# EAGLE schematic RemoteHardware (EAGLE 9.3.0)
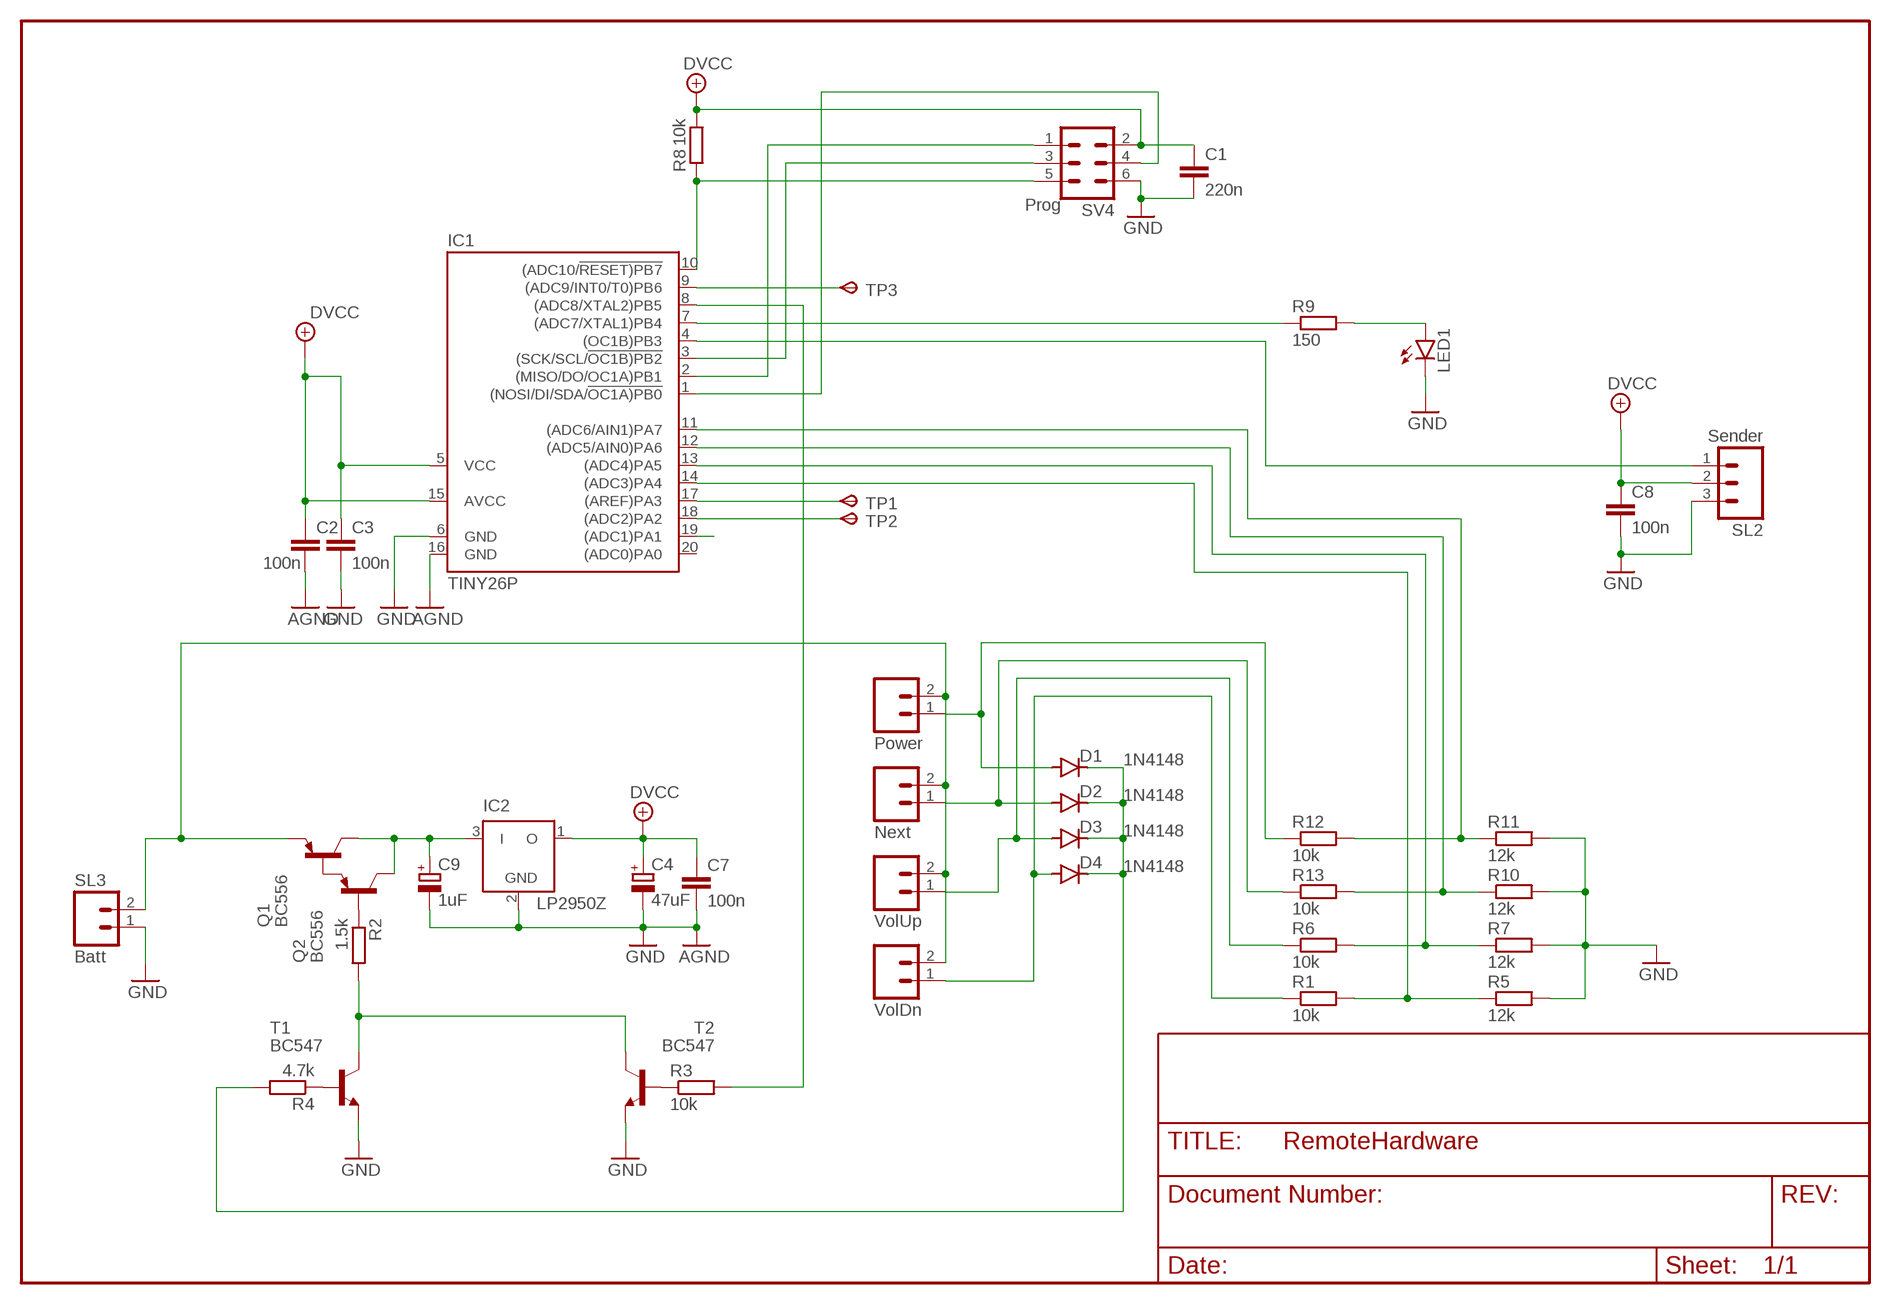
[diagram p0: schematic, sheet 1]

## Parts
C1  220n  C-EU025-024X044  [C025-024X044]
C2  100n  C-EU025-024X044  [C025-024X044]
C3  100n  C-EU025-024X044  [C025-024X044]
C4  47uF  CPOL-EUE2.5-6  [E2,5-6]
C7  100n  C-EU025-024X044  [C025-024X044]
C8  100n  C-EU025-024X044  [C025-024X044]
C9  1uF  CPOL-EUE2.5-6  [E2,5-6]
D1  1N4148  DIODE-D-5  [D-5]
D2  1N4148  DIODE-D-5  [D-5]
D3  1N4148  DIODE-D-5  [D-5]
D4  1N4148  DIODE-D-5  [D-5]
IC1  TINY26P  [DIL20]
IC2  LP2950Z  [TO92]
LED1  LED3MM  [LED3MM]
Q1  BC556  [TO92-EBC]
Q2  BC556  [TO92-EBC]
R1  10k  R-EU_0204/5  [0204/5]
R2  1.5k  R-EU_0204/5  [0204/5]
R3  10k  R-EU_0204/5  [0204/5]
R4  4.7k  R-EU_0204/5  [0204/5]
R5  12k  R-EU_0204/5  [0204/5]
R6  10k  R-EU_0204/5  [0204/5]
R7  12k  R-EU_0204/5  [0204/5]
R8  10k  R-EU_0204/5  [0204/5]
R9  150  R-EU_0204/5  [0204/5]
R10  12k  R-EU_0204/5  [0204/5]
R11  12k  R-EU_0204/5  [0204/5]
R12  10k  R-EU_0204/5  [0204/5]
R13  10k  R-EU_0204/5  [0204/5]
SL1  Power  M02  [02P]
SL2  Sender  M03  [03P]
SL3  Batt  M02  [02P]
SL4  Next  M02  [02P]
SL5  VolUp  M02  [02P]
SL6  VolDn  M02  [02P]
SV4  Prog  MA03-2  [MA03-2]
T1  BC547  [TO92]
T2  BC547  [TO92]
TP1  TPSB1,27  [B1,27]
TP2  TPSB1,27  [B1,27]
TP3  TPSB1,27  [B1,27]

## Nets
+5V: C1.1 C2.1 C3.1 C4.+ C7.1 C8.1 IC1.5(VCC) IC1.15(AVCC) IC2.1(O) R8.2 SL2.2 SV4.2 ; supply symbol labelled DVCC
GND: C1.2 C2.2 C3.2 C4.- C7.2 C8.2 C9.- IC1.6(GND) IC1.16(GND) IC2.2(GND) LED1.K(C) R5.2 R7.2 R10.2 R11.2 SL2.3 SL3.1 SV4.6 T1.1(E) T2.1(E) ; supply symbol labelled AGND
N$1: IC1.17((AREF)PA3) TP1.TP(PP)
N$2: IC1.19((ADC1)PA1)
N$3: D1.C D2.C D3.C D4.C R4.2
N$4: D2.A R13.1 SL4.1
N$5: LED1.A R9.2
N$6: R4.1 T1.2(B)
N$7: Q1.B Q2.E
N$8: R2.2 T1.3(C) T2.3(C)
N$9: R3.1 T2.2(B)
N$11: IC1.8((ADC8/XTAL2)PB5) R3.2
N$12: IC1.18((ADC2)PA2) TP2.TP(PP)
N$15: IC1.2((MISO/DO/OC1A)PB1) SV4.1
N$16: D4.A R1.1 SL6.1
N$17: D3.A R6.1 SL5.1
N$18: IC1.4((OC1B)PB3) SL2.1
N$19: IC1.7((ADC7/XTAL1)PB4) R9.1
N$20: Q1.E SL1.2 SL3.2 SL4.2 SL5.2 SL6.2
N$21: IC1.10((ADC10/!RESET)PB7) R8.1 SV4.5
N$22: IC1.3((SCK/SCL/!OC1B)PB2) SV4.3
N$23: IC1.1((NOSI/DI/SDA/!OC1A)PB0) SV4.4
N$24: IC1.14((ADC3)PA4) R1.2 R5.1
N$25: IC1.13((ADC4)PA5) R6.2 R7.1
N$26: IC1.9((ADC9/INT0/T0)PB6) TP3.TP(PP)
N$27: C9.+ IC2.3(I) Q1.C Q2.C
N$28: Q2.B R2.1
N$29: IC1.12((ADC5/AIN0)PA6) R10.1 R13.2
N$30: IC1.11((ADC6/AIN1)PA7) R11.1 R12.2
N$32: D1.A R12.1 SL1.1
Unconnected: IC1.20((ADC0)PA0)

## Library data of the parts
C1-C3 C7 C8 = rcl:C-EU: CAPACITOR, European symbol
C4 C9 = rcl:CPOL-EU: POLARIZED CAPACITOR, European symbol; SPICEPREFIX: C
D1-D4 = diode:DIODE-: DIODE
IC1 = atmel:TINY26*: 8-bit AVR Microcontroller with 2K Bytes Flash Source: http://www.atmel.com .. doc1477.pdf
IC2 = linear:LP2950: 100 mA, Low Power Low Dropout Voltage Regulator Source: http://www.onsemi.com/pub/Collateral/LP2950-D.PDF
LED1 = led:LED: LED OSRAM: - CHIPLED LG R971, LG N971, LY N971, LG Q971, LY Q971, LO R971, LY R971 LH N974, LH R974 LS Q976, LO Q976, LY Q976 LO Q996 - Hyper CHIPLED LW Q18S LB Q993, LB Q99A, LB R99A - SideLED LS A670, LO A670, LY A670, LG A670, LP A670 LB A673, LV A673, LT A673, LW A673 LH A674 LY A675 LS A676, LA A676, LO A676, LY A676, LW A676 LS A679, LY A679, LG A679 - Hyper Micro SIDELED® LS Y876, LA Y876, LO Y876, LY Y876 LT Y87S - SmartLED LW L88C, LW L88S LB L89C, LB L89S, LG L890 LS L89K, LO L89K, LY L89K LS L896, LA L896, LO L896, LY L896 - TOPLED LS T670, LO T670, LY T670, LG T670, LP T670 LSG T670, LSP T670, LSY T670, LOP T670, LYG T670 LG T671, LOG T671, LSG T671 LB T673, LV T673, LT T673, LW T673 LH T674 LS T676, LA T676, LO T676, LY T676, LB T676, LH T676, LSB T676, LW T676 LB T67C, LV T67C, LT T67C, LS T67K, LO T67K, LY T67K, LW E67C LS E67B, LA E67B, LO E67B, LY E67B, LB E67C, LV E67C, LT E67C LW T67C LS T679, LY T679, LG T679 LS T770, LO T770, LY T770, LG T770, LP T770 LB T773, LV T773, LT T773, LW T773 LH T774 LS E675, LA E675, LY E675, LS T675 LS T776, LA T776, LO T776, LY T776, LB T776 LHGB T686 LT T68C, LB T68C - Hyper Mini TOPLED® LB M676 - Mini TOPLED Santana® LG M470 LS M47K, LO M47K, LY M47K Source: http://www.osram.convergy.de LUXEON: - LUMILED® LXK2-PW12-R00, LXK2-PW12-S00, LXK2-PW14-U00, LXK2-PW14-V00 LXK2-PM12-R00, LXK2-PM12-S00, LXK2-PM14-U00 LXK2-PE12-Q00, LXK2-PE12-R00, LXK2-PE12-S00, LXK2-PE14-T00, LXK2-PE14-U00 LXK2-PB12-K00, LXK2-PB12-L00, LXK2-PB12-M00, LXK2-PB14-N00, LXK2-PB14-P00, LXK2-PB14-Q00 LXK2-PR12-L00, LXK2-PR12-M00, LXK2-PR14-Q00, LXK2-PR14-R00 LXK2-PD12-Q00, LXK2-PD12-R00, LXK2-PD12-S00 LXK2-PH12-R00, LXK2-PH12-S00 LXK2-PL12-P00, LXK2-PL12-Q00, LXK2-PL12-R00 Source: www.luxeon.com KINGBRIGHT: KA-3528ASYC Source: www.kingbright.com
Q1 Q2 = transistor-pnp:BC556*: PNP Transistror
R1-R13 = rcl:R-EU_: RESISTOR, European symbol
SL1 SL3-SL6 = con-amp-quick:M02: AMP QUICK CONNECTOR
SL2 = con-amp-quick:M03: AMP QUICK CONNECTOR
SV4 = con-lstb:MA03-2: PIN HEADER
T1 T2 = transistor:BC547: NPN TRANSISTOR
TP1-TP3 = testpad:TPS: TEST PIN